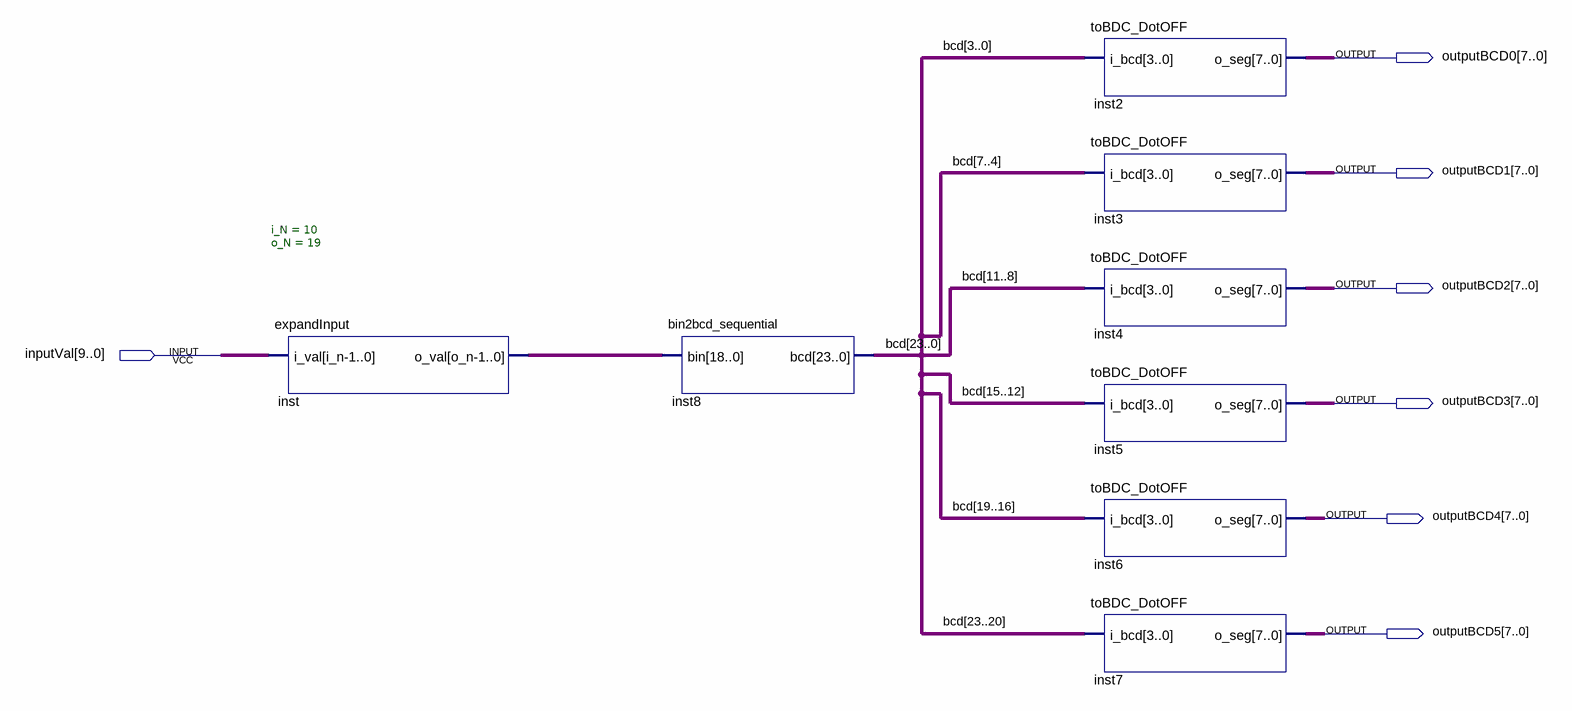
[diagram p0: schematic sheet]
// Quartus schematic SegDisplay_De10Lite.bdf as structural Verilog: 8 symbols, 7 pins
module SegDisplay_De10Lite (
  input  [9:0] inputVal,
  output [7:0] outputBCD0,
  output [7:0] outputBCD1,
  output [7:0] outputBCD2,
  output [7:0] outputBCD3,
  output [7:0] outputBCD4,
  output [7:0] outputBCD5
);

  wire [18:0] inst_o_val;
  wire [23:0] bcd;

  expandInput #(.i_N(10), .o_N(19)) inst (.i_val(inputVal), .o_val(inst_o_val));
  bin2bcd_sequential inst8 (.bin(inst_o_val), .bcd(bcd));
  toBDC_DotOFF inst2 (.i_bcd(bcd[3:0]), .o_seg(outputBCD0));
  toBDC_DotOFF inst3 (.i_bcd(bcd[7:4]), .o_seg(outputBCD1));
  toBDC_DotOFF inst4 (.i_bcd(bcd[11:8]), .o_seg(outputBCD2));
  toBDC_DotOFF inst5 (.i_bcd(bcd[15:12]), .o_seg(outputBCD3));
  toBDC_DotOFF inst6 (.i_bcd(bcd[19:16]), .o_seg(outputBCD4));
  toBDC_DotOFF inst7 (.i_bcd(bcd[23:20]), .o_seg(outputBCD5));
endmodule
